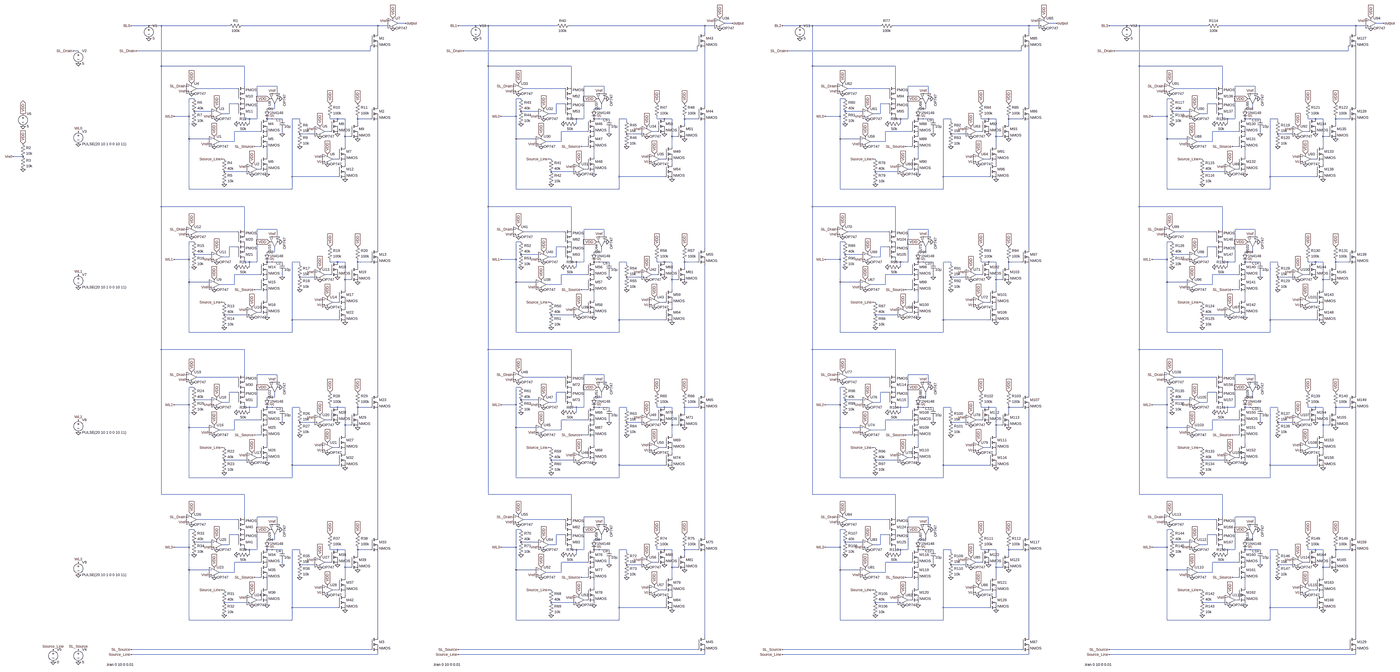
[diagram p0: schematic nand_flash_4x4.asc, whole sheet]
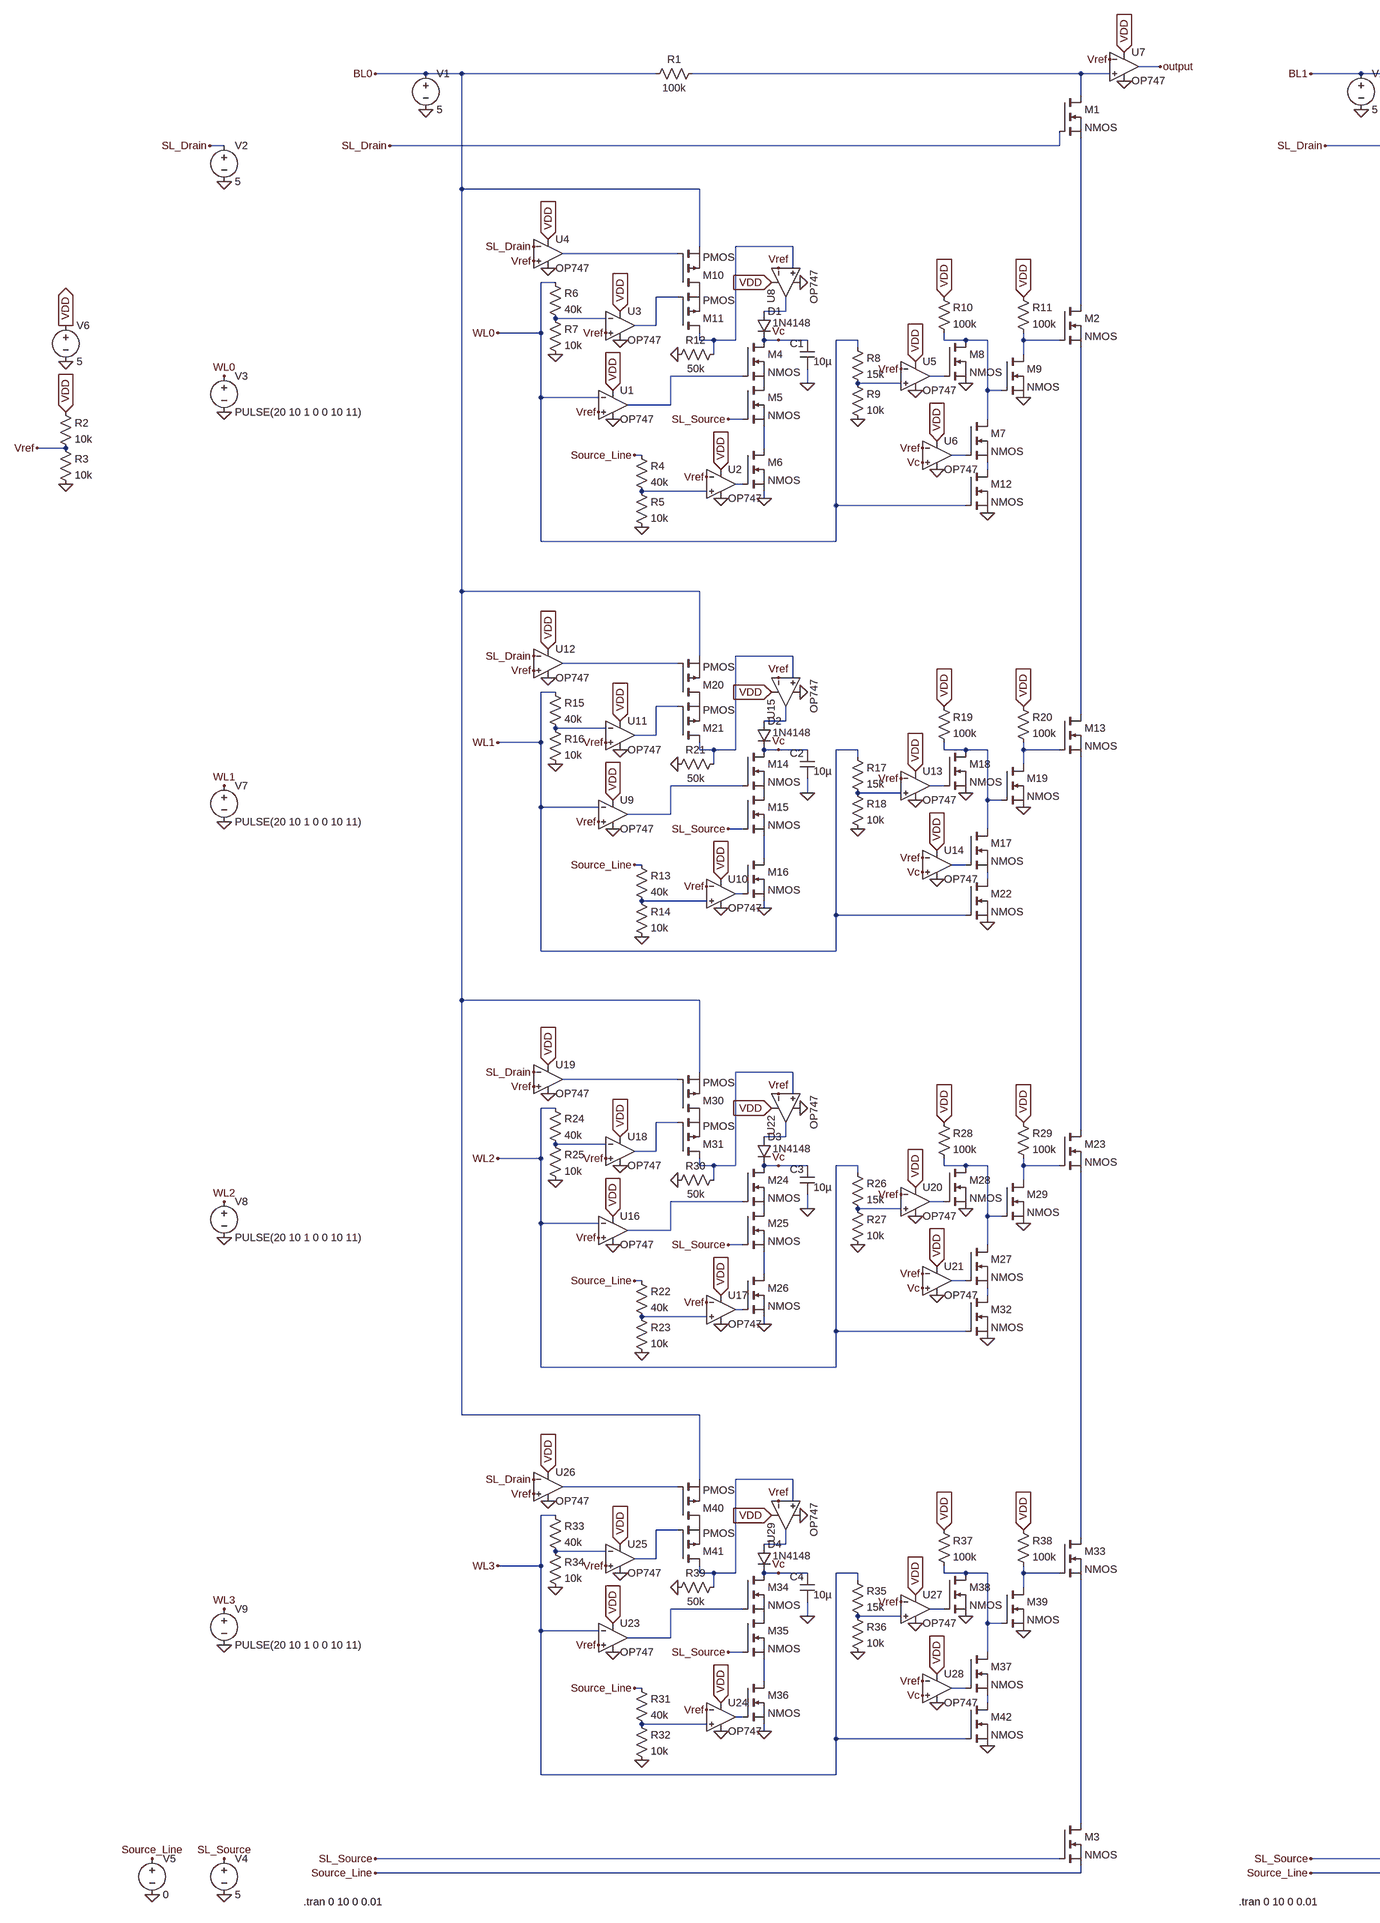
[diagram p1: schematic nand_flash_4x4.asc, part, row 1 of 1, column 1 of 3]
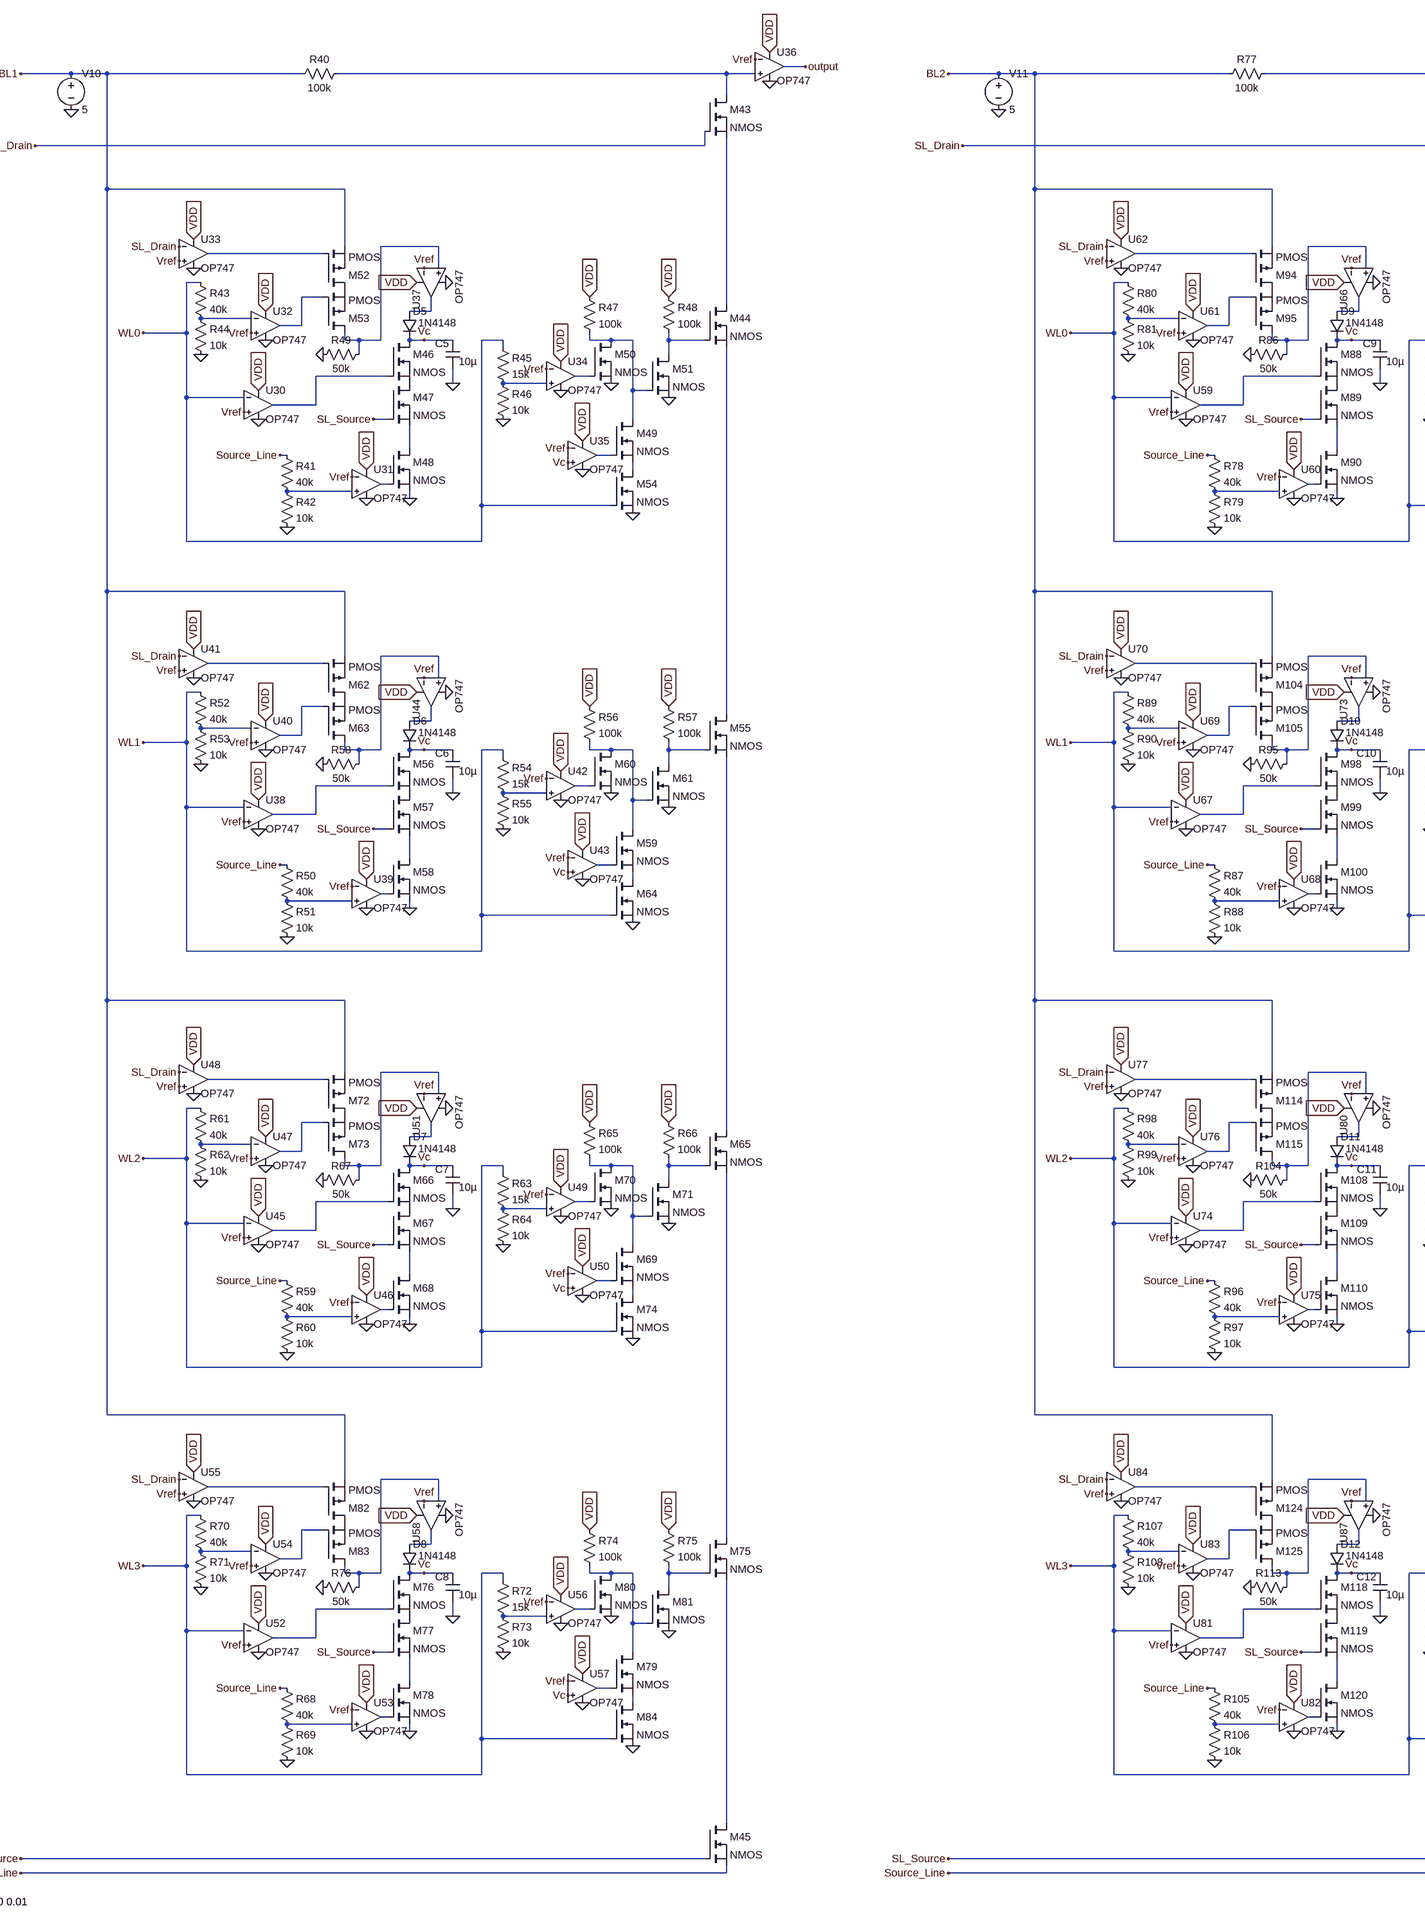
[diagram p2: schematic nand_flash_4x4.asc, part, row 1 of 1, column 2 of 3]
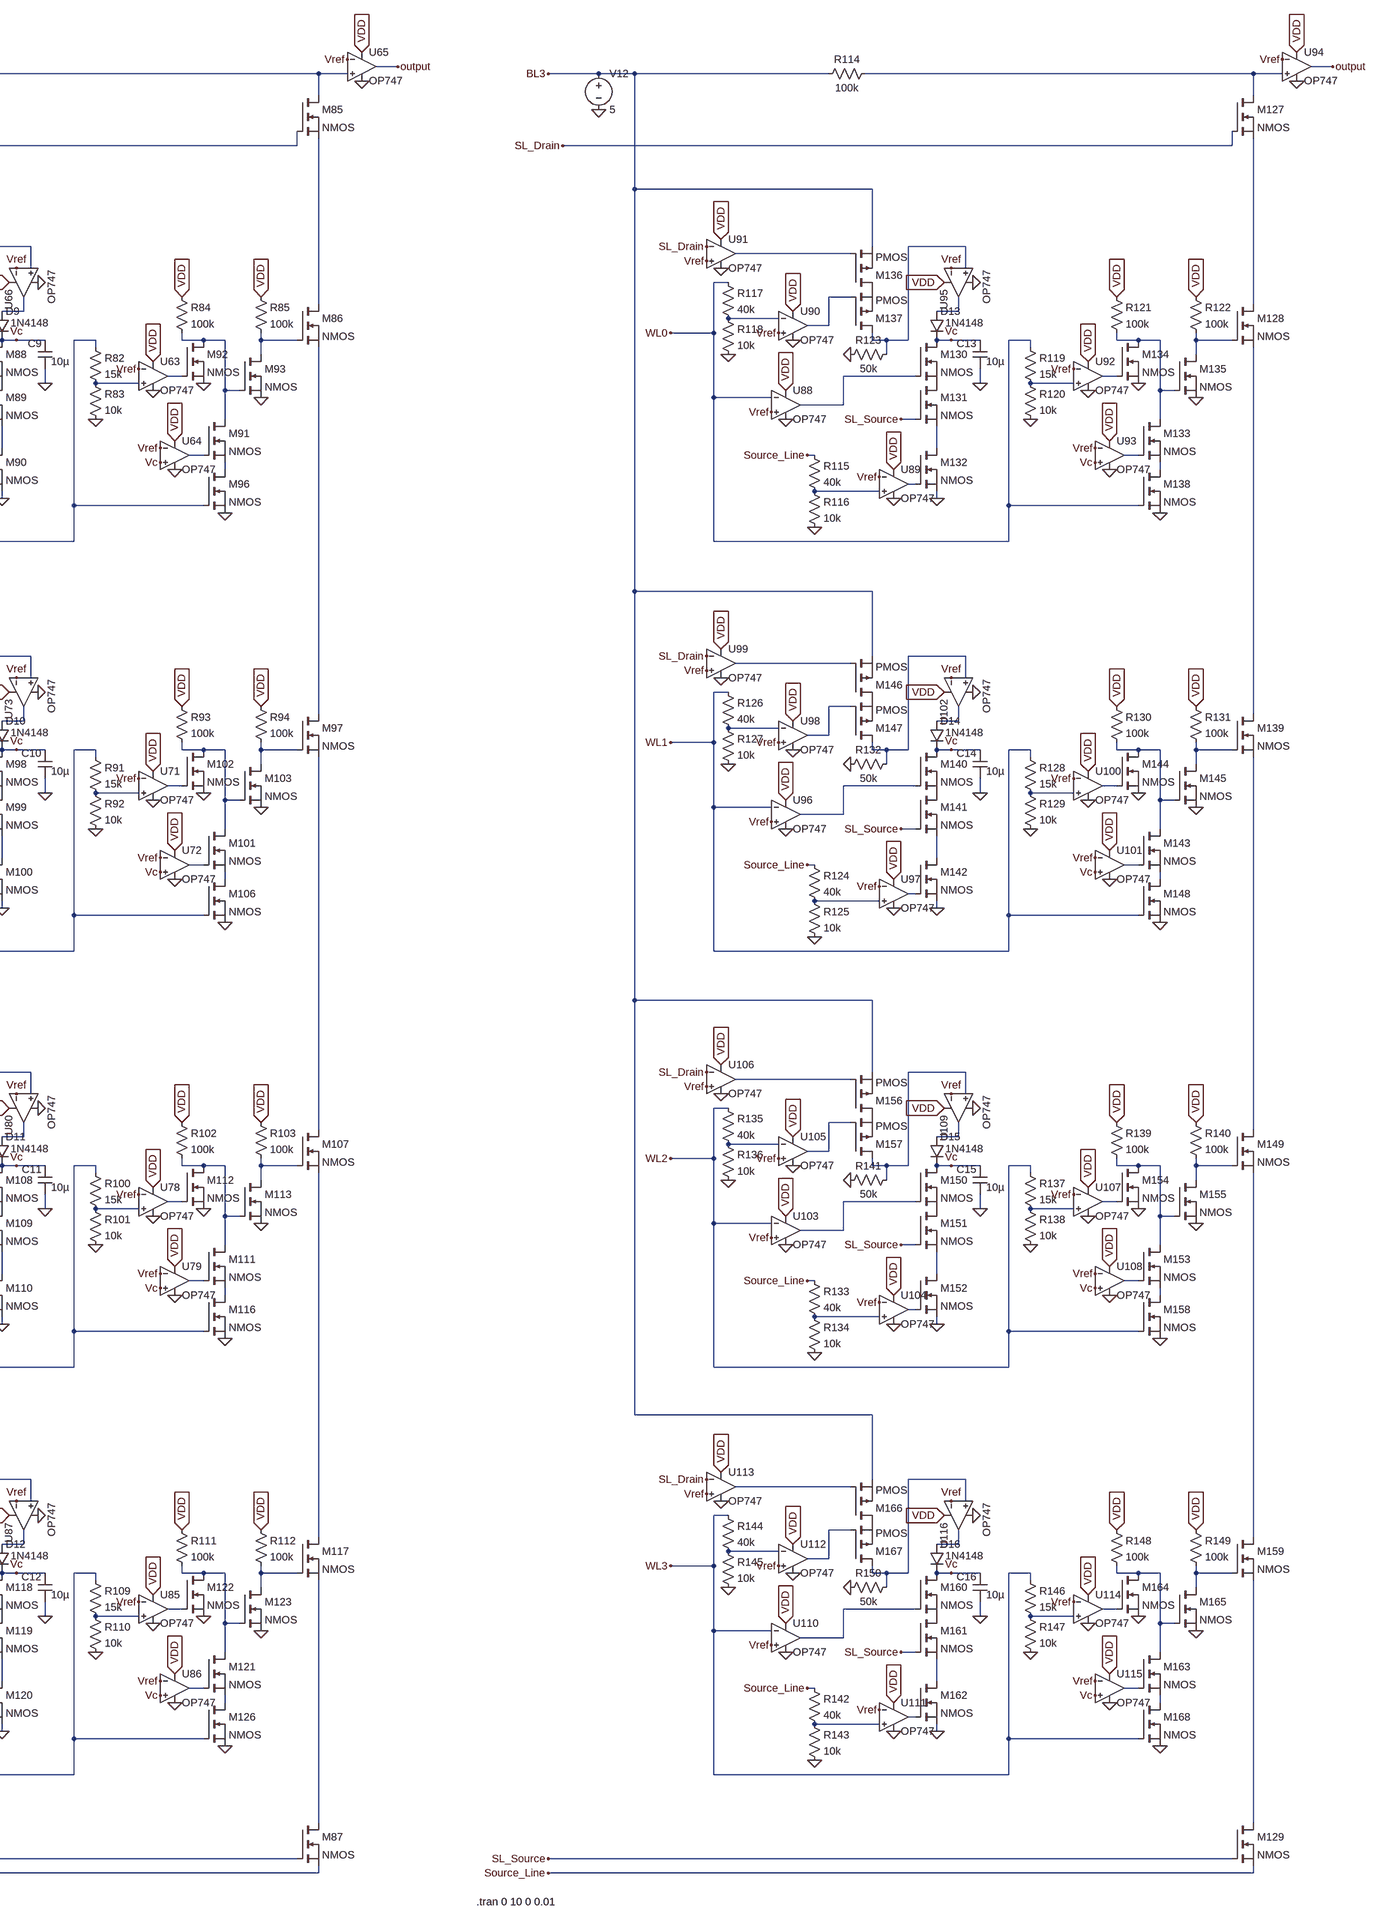
[diagram p3: schematic nand_flash_4x4.asc, part, row 1 of 1, column 3 of 3]
* nand_flash_4x4.asc
M1 N001 SL_Drain N017 N017 NMOS
M2 N017 N030 N081 N081 NMOS
C1 0 Vc 10µ
M3 N261 SL_Source Source_Line Source_Line NMOS
M4 Vc N037 P001 P001 NMOS
V1 BL0 0 5
V2 SL_Drain 0 5
V3 WL0 0 PULSE(20 10 1 0 0 10 11)
V4 SL_Source 0 5
V5 Source_Line 0 0
V6 VDD 0 5
R1 N001 BL0 100k
M5 P001 SL_Source N049 N049 NMOS
M6 N049 N061 0 0 NMOS
R2 VDD Vref 10k
R3 Vref 0 10k
XU1 Vref WL0 VDD 0 N037 OP747  ; pins In+ In- V+ V- OUT
XU2 N065 Vref VDD 0 N061 OP747  ; pins In+ In- V+ V- OUT
XU3 Vref N025 VDD 0 N013 OP747  ; pins In+ In- V+ V- OUT
XU4 Vref SL_Drain VDD 0 N009 OP747  ; pins In+ In- V+ V- OUT
R4 Source_Line N065 40k
R5 N065 0 10k
R6 WL0 N025 40k
R7 N025 0 10k
XU5 N045 Vref VDD 0 N038 OP747  ; pins In+ In- V+ V- OUT
XU6 Vc Vref VDD 0 N053 OP747  ; pins In+ In- V+ V- OUT
R8 WL0 N045 15k
R9 N045 0 10k
M7 N029 N053 N057 N057 NMOS
M8 N029 N038 0 0 NMOS
R10 VDD N029 100k
M9 N030 N029 0 0 NMOS
R11 VDD N030 100k
XU7 N001 Vref VDD 0 output OP747  ; pins In+ In- V+ V- OUT
M10 P002 N009 BL0 BL0 PMOS
M11 N005 N013 P002 P002 PMOS
XU8 N005 Vref VDD 0 N021 OP747  ; pins In+ In- V+ V- OUT
R12 N005 0 50k
D1 N021 Vc 1N4148
M12 N057 WL0 0 0 NMOS
M13 N081 N094 N145 N145 NMOS
C2 0 Vc 10µ
M14 Vc N101 P003 P003 NMOS
V7 WL1 0 PULSE(20 10 1 0 0 10 11)
M15 P003 SL_Source N113 N113 NMOS
M16 N113 N125 0 0 NMOS
XU9 Vref WL1 VDD 0 N101 OP747  ; pins In+ In- V+ V- OUT
XU10 N129 Vref VDD 0 N125 OP747  ; pins In+ In- V+ V- OUT
XU11 Vref N089 VDD 0 N077 OP747  ; pins In+ In- V+ V- OUT
XU12 Vref SL_Drain VDD 0 N073 OP747  ; pins In+ In- V+ V- OUT
R13 Source_Line N129 40k
R14 N129 0 10k
R15 WL1 N089 40k
R16 N089 0 10k
XU13 N109 Vref VDD 0 N102 OP747  ; pins In+ In- V+ V- OUT
XU14 Vc Vref VDD 0 N117 OP747  ; pins In+ In- V+ V- OUT
R17 WL1 N109 15k
R18 N109 0 10k
M17 N093 N117 N121 N121 NMOS
M18 N093 N102 0 0 NMOS
R19 VDD N093 100k
M19 N094 N093 0 0 NMOS
R20 VDD N094 100k
M20 P004 N073 BL0 BL0 PMOS
M21 N069 N077 P004 P004 PMOS
XU15 N069 Vref VDD 0 N085 OP747  ; pins In+ In- V+ V- OUT
R21 N069 0 50k
D2 N085 Vc 1N4148
M22 N121 WL1 0 0 NMOS
M23 N145 N158 N209 N209 NMOS
C3 0 Vc 10µ
M24 Vc N165 P005 P005 NMOS
V8 WL2 0 PULSE(20 10 1 0 0 10 11)
M25 P005 SL_Source N177 N177 NMOS
M26 N177 N189 0 0 NMOS
XU16 Vref WL2 VDD 0 N165 OP747  ; pins In+ In- V+ V- OUT
XU17 N193 Vref VDD 0 N189 OP747  ; pins In+ In- V+ V- OUT
XU18 Vref N153 VDD 0 N141 OP747  ; pins In+ In- V+ V- OUT
XU19 Vref SL_Drain VDD 0 N137 OP747  ; pins In+ In- V+ V- OUT
R22 Source_Line N193 40k
R23 N193 0 10k
R24 WL2 N153 40k
R25 N153 0 10k
XU20 N173 Vref VDD 0 N166 OP747  ; pins In+ In- V+ V- OUT
XU21 Vc Vref VDD 0 N181 OP747  ; pins In+ In- V+ V- OUT
R26 WL2 N173 15k
R27 N173 0 10k
M27 N157 N181 N185 N185 NMOS
M28 N157 N166 0 0 NMOS
R28 VDD N157 100k
M29 N158 N157 0 0 NMOS
R29 VDD N158 100k
M30 P006 N137 BL0 BL0 PMOS
M31 N133 N141 P006 P006 PMOS
XU22 N133 Vref VDD 0 N149 OP747  ; pins In+ In- V+ V- OUT
R30 N133 0 50k
D3 N149 Vc 1N4148
M32 N185 WL2 0 0 NMOS
M33 N209 N222 N261 N261 NMOS
C4 0 Vc 10µ
M34 Vc N229 P007 P007 NMOS
V9 WL3 0 PULSE(20 10 1 0 0 10 11)
M35 P007 SL_Source N241 N241 NMOS
M36 N241 N253 0 0 NMOS
XU23 Vref WL3 VDD 0 N229 OP747  ; pins In+ In- V+ V- OUT
XU24 N257 Vref VDD 0 N253 OP747  ; pins In+ In- V+ V- OUT
XU25 Vref N217 VDD 0 N205 OP747  ; pins In+ In- V+ V- OUT
XU26 Vref SL_Drain VDD 0 N201 OP747  ; pins In+ In- V+ V- OUT
R31 Source_Line N257 40k
R32 N257 0 10k
R33 WL3 N217 40k
R34 N217 0 10k
XU27 N237 Vref VDD 0 N230 OP747  ; pins In+ In- V+ V- OUT
XU28 Vc Vref VDD 0 N245 OP747  ; pins In+ In- V+ V- OUT
R35 WL3 N237 15k
R36 N237 0 10k
M37 N221 N245 N249 N249 NMOS
M38 N221 N230 0 0 NMOS
R37 VDD N221 100k
M39 N222 N221 0 0 NMOS
R38 VDD N222 100k
M40 P008 N201 BL0 BL0 PMOS
M41 N197 N205 P008 P008 PMOS
XU29 N197 Vref VDD 0 N213 OP747  ; pins In+ In- V+ V- OUT
R39 N197 0 50k
D4 N213 Vc 1N4148
M42 N249 WL3 0 0 NMOS
M43 N002 SL_Drain N018 N018 NMOS
M44 N018 N032 N082 N082 NMOS
C5 0 Vc 10µ
M45 N262 SL_Source Source_Line Source_Line NMOS
M46 Vc N039 P009 P009 NMOS
V10 BL1 0 5
R40 N002 BL1 100k
M47 P009 SL_Source N050 N050 NMOS
M48 N050 N062 0 0 NMOS
XU30 Vref WL0 VDD 0 N039 OP747  ; pins In+ In- V+ V- OUT
XU31 N066 Vref VDD 0 N062 OP747  ; pins In+ In- V+ V- OUT
XU32 Vref N026 VDD 0 N014 OP747  ; pins In+ In- V+ V- OUT
XU33 Vref SL_Drain VDD 0 N010 OP747  ; pins In+ In- V+ V- OUT
R41 Source_Line N066 40k
R42 N066 0 10k
R43 WL0 N026 40k
R44 N026 0 10k
XU34 N046 Vref VDD 0 N040 OP747  ; pins In+ In- V+ V- OUT
XU35 Vc Vref VDD 0 N054 OP747  ; pins In+ In- V+ V- OUT
R45 WL0 N046 15k
R46 N046 0 10k
M49 N031 N054 N058 N058 NMOS
M50 N031 N040 0 0 NMOS
R47 VDD N031 100k
M51 N032 N031 0 0 NMOS
R48 VDD N032 100k
XU36 N002 Vref VDD 0 output OP747  ; pins In+ In- V+ V- OUT
M52 P010 N010 BL1 BL1 PMOS
M53 N006 N014 P010 P010 PMOS
XU37 N006 Vref VDD 0 N022 OP747  ; pins In+ In- V+ V- OUT
R49 N006 0 50k
D5 N022 Vc 1N4148
M54 N058 WL0 0 0 NMOS
M55 N082 N096 N146 N146 NMOS
C6 0 Vc 10µ
M56 Vc N103 P011 P011 NMOS
M57 P011 SL_Source N114 N114 NMOS
M58 N114 N126 0 0 NMOS
XU38 Vref WL1 VDD 0 N103 OP747  ; pins In+ In- V+ V- OUT
XU39 N130 Vref VDD 0 N126 OP747  ; pins In+ In- V+ V- OUT
XU40 Vref N090 VDD 0 N078 OP747  ; pins In+ In- V+ V- OUT
XU41 Vref SL_Drain VDD 0 N074 OP747  ; pins In+ In- V+ V- OUT
R50 Source_Line N130 40k
R51 N130 0 10k
R52 WL1 N090 40k
R53 N090 0 10k
XU42 N110 Vref VDD 0 N104 OP747  ; pins In+ In- V+ V- OUT
XU43 Vc Vref VDD 0 N118 OP747  ; pins In+ In- V+ V- OUT
R54 WL1 N110 15k
R55 N110 0 10k
M59 N095 N118 N122 N122 NMOS
M60 N095 N104 0 0 NMOS
R56 VDD N095 100k
M61 N096 N095 0 0 NMOS
R57 VDD N096 100k
M62 P012 N074 BL1 BL1 PMOS
M63 N070 N078 P012 P012 PMOS
XU44 N070 Vref VDD 0 N086 OP747  ; pins In+ In- V+ V- OUT
R58 N070 0 50k
D6 N086 Vc 1N4148
M64 N122 WL1 0 0 NMOS
M65 N146 N160 N210 N210 NMOS
C7 0 Vc 10µ
M66 Vc N167 P013 P013 NMOS
M67 P013 SL_Source N178 N178 NMOS
M68 N178 N190 0 0 NMOS
XU45 Vref WL2 VDD 0 N167 OP747  ; pins In+ In- V+ V- OUT
XU46 N194 Vref VDD 0 N190 OP747  ; pins In+ In- V+ V- OUT
XU47 Vref N154 VDD 0 N142 OP747  ; pins In+ In- V+ V- OUT
XU48 Vref SL_Drain VDD 0 N138 OP747  ; pins In+ In- V+ V- OUT
R59 Source_Line N194 40k
R60 N194 0 10k
R61 WL2 N154 40k
R62 N154 0 10k
XU49 N174 Vref VDD 0 N168 OP747  ; pins In+ In- V+ V- OUT
XU50 Vc Vref VDD 0 N182 OP747  ; pins In+ In- V+ V- OUT
R63 WL2 N174 15k
R64 N174 0 10k
M69 N159 N182 N186 N186 NMOS
M70 N159 N168 0 0 NMOS
R65 VDD N159 100k
M71 N160 N159 0 0 NMOS
R66 VDD N160 100k
M72 P014 N138 BL1 BL1 PMOS
M73 N134 N142 P014 P014 PMOS
XU51 N134 Vref VDD 0 N150 OP747  ; pins In+ In- V+ V- OUT
R67 N134 0 50k
D7 N150 Vc 1N4148
M74 N186 WL2 0 0 NMOS
M75 N210 N224 N262 N262 NMOS
C8 0 Vc 10µ
M76 Vc N231 P015 P015 NMOS
M77 P015 SL_Source N242 N242 NMOS
M78 N242 N254 0 0 NMOS
XU52 Vref WL3 VDD 0 N231 OP747  ; pins In+ In- V+ V- OUT
XU53 N258 Vref VDD 0 N254 OP747  ; pins In+ In- V+ V- OUT
XU54 Vref N218 VDD 0 N206 OP747  ; pins In+ In- V+ V- OUT
XU55 Vref SL_Drain VDD 0 N202 OP747  ; pins In+ In- V+ V- OUT
R68 Source_Line N258 40k
R69 N258 0 10k
R70 WL3 N218 40k
R71 N218 0 10k
XU56 N238 Vref VDD 0 N232 OP747  ; pins In+ In- V+ V- OUT
XU57 Vc Vref VDD 0 N246 OP747  ; pins In+ In- V+ V- OUT
R72 WL3 N238 15k
R73 N238 0 10k
M79 N223 N246 N250 N250 NMOS
M80 N223 N232 0 0 NMOS
R74 VDD N223 100k
M81 N224 N223 0 0 NMOS
R75 VDD N224 100k
M82 P016 N202 BL1 BL1 PMOS
M83 N198 N206 P016 P016 PMOS
XU58 N198 Vref VDD 0 N214 OP747  ; pins In+ In- V+ V- OUT
R76 N198 0 50k
D8 N214 Vc 1N4148
M84 N250 WL3 0 0 NMOS
M85 N003 SL_Drain N019 N019 NMOS
M86 N019 N034 N083 N083 NMOS
C9 0 Vc 10µ
M87 N263 SL_Source Source_Line Source_Line NMOS
M88 Vc N041 P017 P017 NMOS
V11 BL2 0 5
R77 N003 BL2 100k
M89 P017 SL_Source N051 N051 NMOS
M90 N051 N063 0 0 NMOS
XU59 Vref WL0 VDD 0 N041 OP747  ; pins In+ In- V+ V- OUT
XU60 N067 Vref VDD 0 N063 OP747  ; pins In+ In- V+ V- OUT
XU61 Vref N027 VDD 0 N015 OP747  ; pins In+ In- V+ V- OUT
XU62 Vref SL_Drain VDD 0 N011 OP747  ; pins In+ In- V+ V- OUT
R78 Source_Line N067 40k
R79 N067 0 10k
R80 WL0 N027 40k
R81 N027 0 10k
XU63 N047 Vref VDD 0 N042 OP747  ; pins In+ In- V+ V- OUT
XU64 Vc Vref VDD 0 N055 OP747  ; pins In+ In- V+ V- OUT
R82 WL0 N047 15k
R83 N047 0 10k
M91 N033 N055 N059 N059 NMOS
M92 N033 N042 0 0 NMOS
R84 VDD N033 100k
M93 N034 N033 0 0 NMOS
R85 VDD N034 100k
XU65 N003 Vref VDD 0 output OP747  ; pins In+ In- V+ V- OUT
M94 P018 N011 BL2 BL2 PMOS
M95 N007 N015 P018 P018 PMOS
XU66 N007 Vref VDD 0 N023 OP747  ; pins In+ In- V+ V- OUT
R86 N007 0 50k
D9 N023 Vc 1N4148
M96 N059 WL0 0 0 NMOS
M97 N083 N098 N147 N147 NMOS
C10 0 Vc 10µ
M98 Vc N105 P019 P019 NMOS
M99 P019 SL_Source N115 N115 NMOS
M100 N115 N127 0 0 NMOS
XU67 Vref WL1 VDD 0 N105 OP747  ; pins In+ In- V+ V- OUT
XU68 N131 Vref VDD 0 N127 OP747  ; pins In+ In- V+ V- OUT
XU69 Vref N091 VDD 0 N079 OP747  ; pins In+ In- V+ V- OUT
XU70 Vref SL_Drain VDD 0 N075 OP747  ; pins In+ In- V+ V- OUT
R87 Source_Line N131 40k
R88 N131 0 10k
R89 WL1 N091 40k
R90 N091 0 10k
XU71 N111 Vref VDD 0 N106 OP747  ; pins In+ In- V+ V- OUT
XU72 Vc Vref VDD 0 N119 OP747  ; pins In+ In- V+ V- OUT
R91 WL1 N111 15k
R92 N111 0 10k
M101 N097 N119 N123 N123 NMOS
M102 N097 N106 0 0 NMOS
R93 VDD N097 100k
M103 N098 N097 0 0 NMOS
R94 VDD N098 100k
M104 P020 N075 BL2 BL2 PMOS
M105 N071 N079 P020 P020 PMOS
XU73 N071 Vref VDD 0 N087 OP747  ; pins In+ In- V+ V- OUT
R95 N071 0 50k
D10 N087 Vc 1N4148
M106 N123 WL1 0 0 NMOS
M107 N147 N162 N211 N211 NMOS
C11 0 Vc 10µ
M108 Vc N169 P021 P021 NMOS
M109 P021 SL_Source N179 N179 NMOS
M110 N179 N191 0 0 NMOS
XU74 Vref WL2 VDD 0 N169 OP747  ; pins In+ In- V+ V- OUT
XU75 N195 Vref VDD 0 N191 OP747  ; pins In+ In- V+ V- OUT
XU76 Vref N155 VDD 0 N143 OP747  ; pins In+ In- V+ V- OUT
XU77 Vref SL_Drain VDD 0 N139 OP747  ; pins In+ In- V+ V- OUT
R96 Source_Line N195 40k
R97 N195 0 10k
R98 WL2 N155 40k
R99 N155 0 10k
XU78 N175 Vref VDD 0 N170 OP747  ; pins In+ In- V+ V- OUT
XU79 Vc Vref VDD 0 N183 OP747  ; pins In+ In- V+ V- OUT
R100 WL2 N175 15k
R101 N175 0 10k
M111 N161 N183 N187 N187 NMOS
M112 N161 N170 0 0 NMOS
R102 VDD N161 100k
M113 N162 N161 0 0 NMOS
R103 VDD N162 100k
M114 P022 N139 BL2 BL2 PMOS
M115 N135 N143 P022 P022 PMOS
XU80 N135 Vref VDD 0 N151 OP747  ; pins In+ In- V+ V- OUT
R104 N135 0 50k
D11 N151 Vc 1N4148
M116 N187 WL2 0 0 NMOS
M117 N211 N226 N263 N263 NMOS
C12 0 Vc 10µ
M118 Vc N233 P023 P023 NMOS
M119 P023 SL_Source N243 N243 NMOS
M120 N243 N255 0 0 NMOS
XU81 Vref WL3 VDD 0 N233 OP747  ; pins In+ In- V+ V- OUT
XU82 N259 Vref VDD 0 N255 OP747  ; pins In+ In- V+ V- OUT
XU83 Vref N219 VDD 0 N207 OP747  ; pins In+ In- V+ V- OUT
XU84 Vref SL_Drain VDD 0 N203 OP747  ; pins In+ In- V+ V- OUT
R105 Source_Line N259 40k
R106 N259 0 10k
R107 WL3 N219 40k
R108 N219 0 10k
XU85 N239 Vref VDD 0 N234 OP747  ; pins In+ In- V+ V- OUT
XU86 Vc Vref VDD 0 N247 OP747  ; pins In+ In- V+ V- OUT
R109 WL3 N239 15k
R110 N239 0 10k
M121 N225 N247 N251 N251 NMOS
M122 N225 N234 0 0 NMOS
R111 VDD N225 100k
M123 N226 N225 0 0 NMOS
R112 VDD N226 100k
M124 P024 N203 BL2 BL2 PMOS
M125 N199 N207 P024 P024 PMOS
XU87 N199 Vref VDD 0 N215 OP747  ; pins In+ In- V+ V- OUT
R113 N199 0 50k
D12 N215 Vc 1N4148
M126 N251 WL3 0 0 NMOS
M127 N004 SL_Drain N020 N020 NMOS
M128 N020 N036 N084 N084 NMOS
C13 0 Vc 10µ
M129 N264 SL_Source Source_Line Source_Line NMOS
M130 Vc N043 P025 P025 NMOS
V12 BL3 0 5
R114 N004 BL3 100k
M131 P025 SL_Source N052 N052 NMOS
M132 N052 N064 0 0 NMOS
XU88 Vref WL0 VDD 0 N043 OP747  ; pins In+ In- V+ V- OUT
XU89 N068 Vref VDD 0 N064 OP747  ; pins In+ In- V+ V- OUT
XU90 Vref N028 VDD 0 N016 OP747  ; pins In+ In- V+ V- OUT
XU91 Vref SL_Drain VDD 0 N012 OP747  ; pins In+ In- V+ V- OUT
R115 Source_Line N068 40k
R116 N068 0 10k
R117 WL0 N028 40k
R118 N028 0 10k
XU92 N048 Vref VDD 0 N044 OP747  ; pins In+ In- V+ V- OUT
XU93 Vc Vref VDD 0 N056 OP747  ; pins In+ In- V+ V- OUT
R119 WL0 N048 15k
R120 N048 0 10k
M133 N035 N056 N060 N060 NMOS
M134 N035 N044 0 0 NMOS
R121 VDD N035 100k
M135 N036 N035 0 0 NMOS
R122 VDD N036 100k
XU94 N004 Vref VDD 0 output OP747  ; pins In+ In- V+ V- OUT
M136 P026 N012 BL3 BL3 PMOS
M137 N008 N016 P026 P026 PMOS
XU95 N008 Vref VDD 0 N024 OP747  ; pins In+ In- V+ V- OUT
R123 N008 0 50k
D13 N024 Vc 1N4148
M138 N060 WL0 0 0 NMOS
M139 N084 N100 N148 N148 NMOS
C14 0 Vc 10µ
M140 Vc N107 P027 P027 NMOS
M141 P027 SL_Source N116 N116 NMOS
M142 N116 N128 0 0 NMOS
XU96 Vref WL1 VDD 0 N107 OP747  ; pins In+ In- V+ V- OUT
XU97 N132 Vref VDD 0 N128 OP747  ; pins In+ In- V+ V- OUT
XU98 Vref N092 VDD 0 N080 OP747  ; pins In+ In- V+ V- OUT
XU99 Vref SL_Drain VDD 0 N076 OP747  ; pins In+ In- V+ V- OUT
R124 Source_Line N132 40k
R125 N132 0 10k
R126 WL1 N092 40k
R127 N092 0 10k
XU100 N112 Vref VDD 0 N108 OP747  ; pins In+ In- V+ V- OUT
XU101 Vc Vref VDD 0 N120 OP747  ; pins In+ In- V+ V- OUT
R128 WL1 N112 15k
R129 N112 0 10k
M143 N099 N120 N124 N124 NMOS
M144 N099 N108 0 0 NMOS
R130 VDD N099 100k
M145 N100 N099 0 0 NMOS
R131 VDD N100 100k
M146 P028 N076 BL3 BL3 PMOS
M147 N072 N080 P028 P028 PMOS
XU102 N072 Vref VDD 0 N088 OP747  ; pins In+ In- V+ V- OUT
R132 N072 0 50k
D14 N088 Vc 1N4148
M148 N124 WL1 0 0 NMOS
M149 N148 N164 N212 N212 NMOS
C15 0 Vc 10µ
M150 Vc N171 P029 P029 NMOS
M151 P029 SL_Source N180 N180 NMOS
M152 N180 N192 0 0 NMOS
XU103 Vref WL2 VDD 0 N171 OP747  ; pins In+ In- V+ V- OUT
XU104 N196 Vref VDD 0 N192 OP747  ; pins In+ In- V+ V- OUT
XU105 Vref N156 VDD 0 N144 OP747  ; pins In+ In- V+ V- OUT
XU106 Vref SL_Drain VDD 0 N140 OP747  ; pins In+ In- V+ V- OUT
R133 Source_Line N196 40k
R134 N196 0 10k
R135 WL2 N156 40k
R136 N156 0 10k
XU107 N176 Vref VDD 0 N172 OP747  ; pins In+ In- V+ V- OUT
XU108 Vc Vref VDD 0 N184 OP747  ; pins In+ In- V+ V- OUT
R137 WL2 N176 15k
R138 N176 0 10k
M153 N163 N184 N188 N188 NMOS
M154 N163 N172 0 0 NMOS
R139 VDD N163 100k
M155 N164 N163 0 0 NMOS
R140 VDD N164 100k
M156 P030 N140 BL3 BL3 PMOS
M157 N136 N144 P030 P030 PMOS
XU109 N136 Vref VDD 0 N152 OP747  ; pins In+ In- V+ V- OUT
R141 N136 0 50k
D15 N152 Vc 1N4148
M158 N188 WL2 0 0 NMOS
M159 N212 N228 N264 N264 NMOS
C16 0 Vc 10µ
M160 Vc N235 P031 P031 NMOS
M161 P031 SL_Source N244 N244 NMOS
M162 N244 N256 0 0 NMOS
XU110 Vref WL3 VDD 0 N235 OP747  ; pins In+ In- V+ V- OUT
XU111 N260 Vref VDD 0 N256 OP747  ; pins In+ In- V+ V- OUT
XU112 Vref N220 VDD 0 N208 OP747  ; pins In+ In- V+ V- OUT
XU113 Vref SL_Drain VDD 0 N204 OP747  ; pins In+ In- V+ V- OUT
R142 Source_Line N260 40k
R143 N260 0 10k
R144 WL3 N220 40k
R145 N220 0 10k
XU114 N240 Vref VDD 0 N236 OP747  ; pins In+ In- V+ V- OUT
XU115 Vc Vref VDD 0 N248 OP747  ; pins In+ In- V+ V- OUT
R146 WL3 N240 15k
R147 N240 0 10k
M163 N227 N248 N252 N252 NMOS
M164 N227 N236 0 0 NMOS
R148 VDD N227 100k
M165 N228 N227 0 0 NMOS
R149 VDD N228 100k
M166 P032 N204 BL3 BL3 PMOS
M167 N200 N208 P032 P032 PMOS
XU116 N200 Vref VDD 0 N216 OP747  ; pins In+ In- V+ V- OUT
R150 N200 0 50k
D16 N216 Vc 1N4148
M168 N252 WL3 0 0 NMOS
.model D D
.lib standard.dio
.model NMOS NMOS
.model PMOS PMOS
.lib standard.mos
.tran 0 10 0 0.01
.tran 0 10 0 0.01
.tran 0 10 0 0.01
.backanno
.end